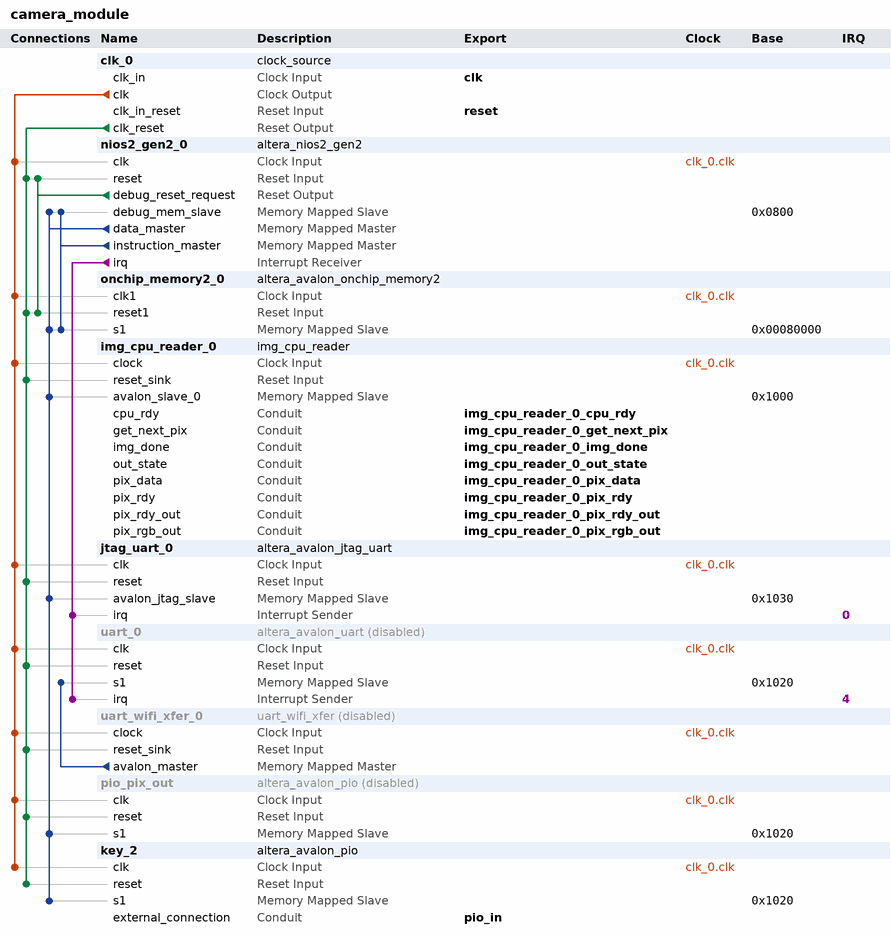
[diagram p0: system contents]
# Platform Designer (Qsys) system camera_module, Cyclone V 5CSEMA5F31C6
# Parameters at their usual value, and those the tool derives, are not listed.
package require -exact qsys 18.1
create_system camera_module
set_project_property DEVICE_FAMILY {Cyclone V}
set_project_property DEVICE 5CSEMA5F31C6

add_instance clk_0 clock_source 18.1
set_instance_parameter_value clk_0 clockFrequency 50000000

add_instance nios2_gen2_0 altera_nios2_gen2 18.1
set_instance_parameter_value nios2_gen2_0 dcache_size 2048
set_instance_parameter_value nios2_gen2_0 exceptionSlave onchip_memory2_0.s1
set_instance_parameter_value nios2_gen2_0 icache_size 4096
set_instance_parameter_value nios2_gen2_0 impl Tiny
set_instance_parameter_value nios2_gen2_0 resetSlave onchip_memory2_0.s1

add_instance onchip_memory2_0 altera_avalon_onchip_memory2 18.1
set_instance_parameter_value onchip_memory2_0 dataWidth 32
set_instance_parameter_value onchip_memory2_0 dualPort false
set_instance_parameter_value onchip_memory2_0 initMemContent true
set_instance_parameter_value onchip_memory2_0 initializationFileName onchip_mem.hex
set_instance_parameter_value onchip_memory2_0 memorySize 160768

add_instance img_cpu_reader_0 img_cpu_reader 1.0

add_instance jtag_uart_0 altera_avalon_jtag_uart 18.1
set_instance_parameter_value jtag_uart_0 simInteractiveOptions NO_INTERACTIVE_WINDOWS

add_instance uart_0 altera_avalon_uart 18.1
set_instance_property uart_0 ENABLED false
set_instance_parameter_value uart_0 baud 115200
set_instance_parameter_value uart_0 dataBits 8
set_instance_parameter_value uart_0 fixedBaud true
set_instance_parameter_value uart_0 parity NONE
set_instance_parameter_value uart_0 stopBits 1

add_instance uart_wifi_xfer_0 uart_wifi_xfer 1.0
set_instance_property uart_wifi_xfer_0 ENABLED false

add_instance pio_pix_out altera_avalon_pio 18.1
set_instance_property pio_pix_out ENABLED false
set_instance_parameter_value pio_pix_out direction Output
set_instance_parameter_value pio_pix_out width 24

add_instance key_2 altera_avalon_pio 18.1
set_instance_parameter_value key_2 direction Input
set_instance_parameter_value key_2 width 1

# connections
add_connection clk_0.clk img_cpu_reader_0.clock clock
add_connection clk_0.clk jtag_uart_0.clk clock
add_connection clk_0.clk key_2.clk clock
add_connection clk_0.clk nios2_gen2_0.clk clock
add_connection clk_0.clk onchip_memory2_0.clk1 clock
add_connection clk_0.clk pio_pix_out.clk clock
add_connection clk_0.clk uart_0.clk clock
add_connection clk_0.clk uart_wifi_xfer_0.clock clock
add_connection clk_0.clk_reset img_cpu_reader_0.reset_sink reset
add_connection clk_0.clk_reset jtag_uart_0.reset reset
add_connection clk_0.clk_reset key_2.reset reset
add_connection clk_0.clk_reset nios2_gen2_0.reset reset
add_connection clk_0.clk_reset onchip_memory2_0.reset1 reset
add_connection clk_0.clk_reset pio_pix_out.reset reset
add_connection clk_0.clk_reset uart_0.reset reset
add_connection clk_0.clk_reset uart_wifi_xfer_0.reset_sink reset
add_connection nios2_gen2_0.debug_reset_request nios2_gen2_0.reset reset
add_connection nios2_gen2_0.debug_reset_request onchip_memory2_0.reset1 reset
add_connection nios2_gen2_0.data_master img_cpu_reader_0.avalon_slave_0 avalon
set_connection_parameter_value nios2_gen2_0.data_master/img_cpu_reader_0.avalon_slave_0 baseAddress 0x1000
add_connection nios2_gen2_0.data_master jtag_uart_0.avalon_jtag_slave avalon
set_connection_parameter_value nios2_gen2_0.data_master/jtag_uart_0.avalon_jtag_slave baseAddress 0x1030
add_connection nios2_gen2_0.data_master key_2.s1 avalon
set_connection_parameter_value nios2_gen2_0.data_master/key_2.s1 baseAddress 0x1020
add_connection nios2_gen2_0.data_master nios2_gen2_0.debug_mem_slave avalon
set_connection_parameter_value nios2_gen2_0.data_master/nios2_gen2_0.debug_mem_slave baseAddress 0x0800
add_connection nios2_gen2_0.data_master onchip_memory2_0.s1 avalon
set_connection_parameter_value nios2_gen2_0.data_master/onchip_memory2_0.s1 baseAddress 0x00080000
add_connection nios2_gen2_0.data_master pio_pix_out.s1 avalon
set_connection_parameter_value nios2_gen2_0.data_master/pio_pix_out.s1 baseAddress 0x1020
add_connection nios2_gen2_0.instruction_master nios2_gen2_0.debug_mem_slave avalon
set_connection_parameter_value nios2_gen2_0.instruction_master/nios2_gen2_0.debug_mem_slave baseAddress 0x0800
add_connection nios2_gen2_0.instruction_master onchip_memory2_0.s1 avalon
set_connection_parameter_value nios2_gen2_0.instruction_master/onchip_memory2_0.s1 baseAddress 0x00080000
add_connection uart_wifi_xfer_0.avalon_master uart_0.s1 avalon
set_connection_parameter_value uart_wifi_xfer_0.avalon_master/uart_0.s1 baseAddress 0x1020
add_connection nios2_gen2_0.irq jtag_uart_0.irq interrupt
set_connection_parameter_value nios2_gen2_0.irq/jtag_uart_0.irq irqNumber 0
add_connection nios2_gen2_0.irq uart_0.irq interrupt
set_connection_parameter_value nios2_gen2_0.irq/uart_0.irq irqNumber 4

# exported interfaces
add_interface clk clock sink
set_interface_property clk EXPORT_OF clk_0.clk_in
add_interface img_cpu_reader_0_cpu_rdy conduit end
set_interface_property img_cpu_reader_0_cpu_rdy EXPORT_OF img_cpu_reader_0.cpu_rdy
add_interface img_cpu_reader_0_get_next_pix conduit end
set_interface_property img_cpu_reader_0_get_next_pix EXPORT_OF img_cpu_reader_0.get_next_pix
add_interface img_cpu_reader_0_img_done conduit end
set_interface_property img_cpu_reader_0_img_done EXPORT_OF img_cpu_reader_0.img_done
add_interface img_cpu_reader_0_out_state conduit end
set_interface_property img_cpu_reader_0_out_state EXPORT_OF img_cpu_reader_0.out_state
add_interface img_cpu_reader_0_pix_data conduit end
set_interface_property img_cpu_reader_0_pix_data EXPORT_OF img_cpu_reader_0.pix_data
add_interface img_cpu_reader_0_pix_rdy conduit end
set_interface_property img_cpu_reader_0_pix_rdy EXPORT_OF img_cpu_reader_0.pix_rdy
add_interface img_cpu_reader_0_pix_rdy_out conduit end
set_interface_property img_cpu_reader_0_pix_rdy_out EXPORT_OF img_cpu_reader_0.pix_rdy_out
add_interface img_cpu_reader_0_pix_rgb_out conduit end
set_interface_property img_cpu_reader_0_pix_rgb_out EXPORT_OF img_cpu_reader_0.pix_rgb_out
add_interface pio_in conduit end
set_interface_property pio_in EXPORT_OF key_2.external_connection
add_interface reset reset sink
set_interface_property reset EXPORT_OF clk_0.clk_in_reset

set_interconnect_requirement {$system} qsys_mm.clockCrossingAdapter HANDSHAKE
set_interconnect_requirement {$system} qsys_mm.enableEccProtection FALSE
set_interconnect_requirement {$system} qsys_mm.insertDefaultSlave FALSE
set_interconnect_requirement {$system} qsys_mm.maxAdditionalLatency 1

save_system camera_module.qsys
